# EAGLE design P00R4 (EAGLE 9.6.1)
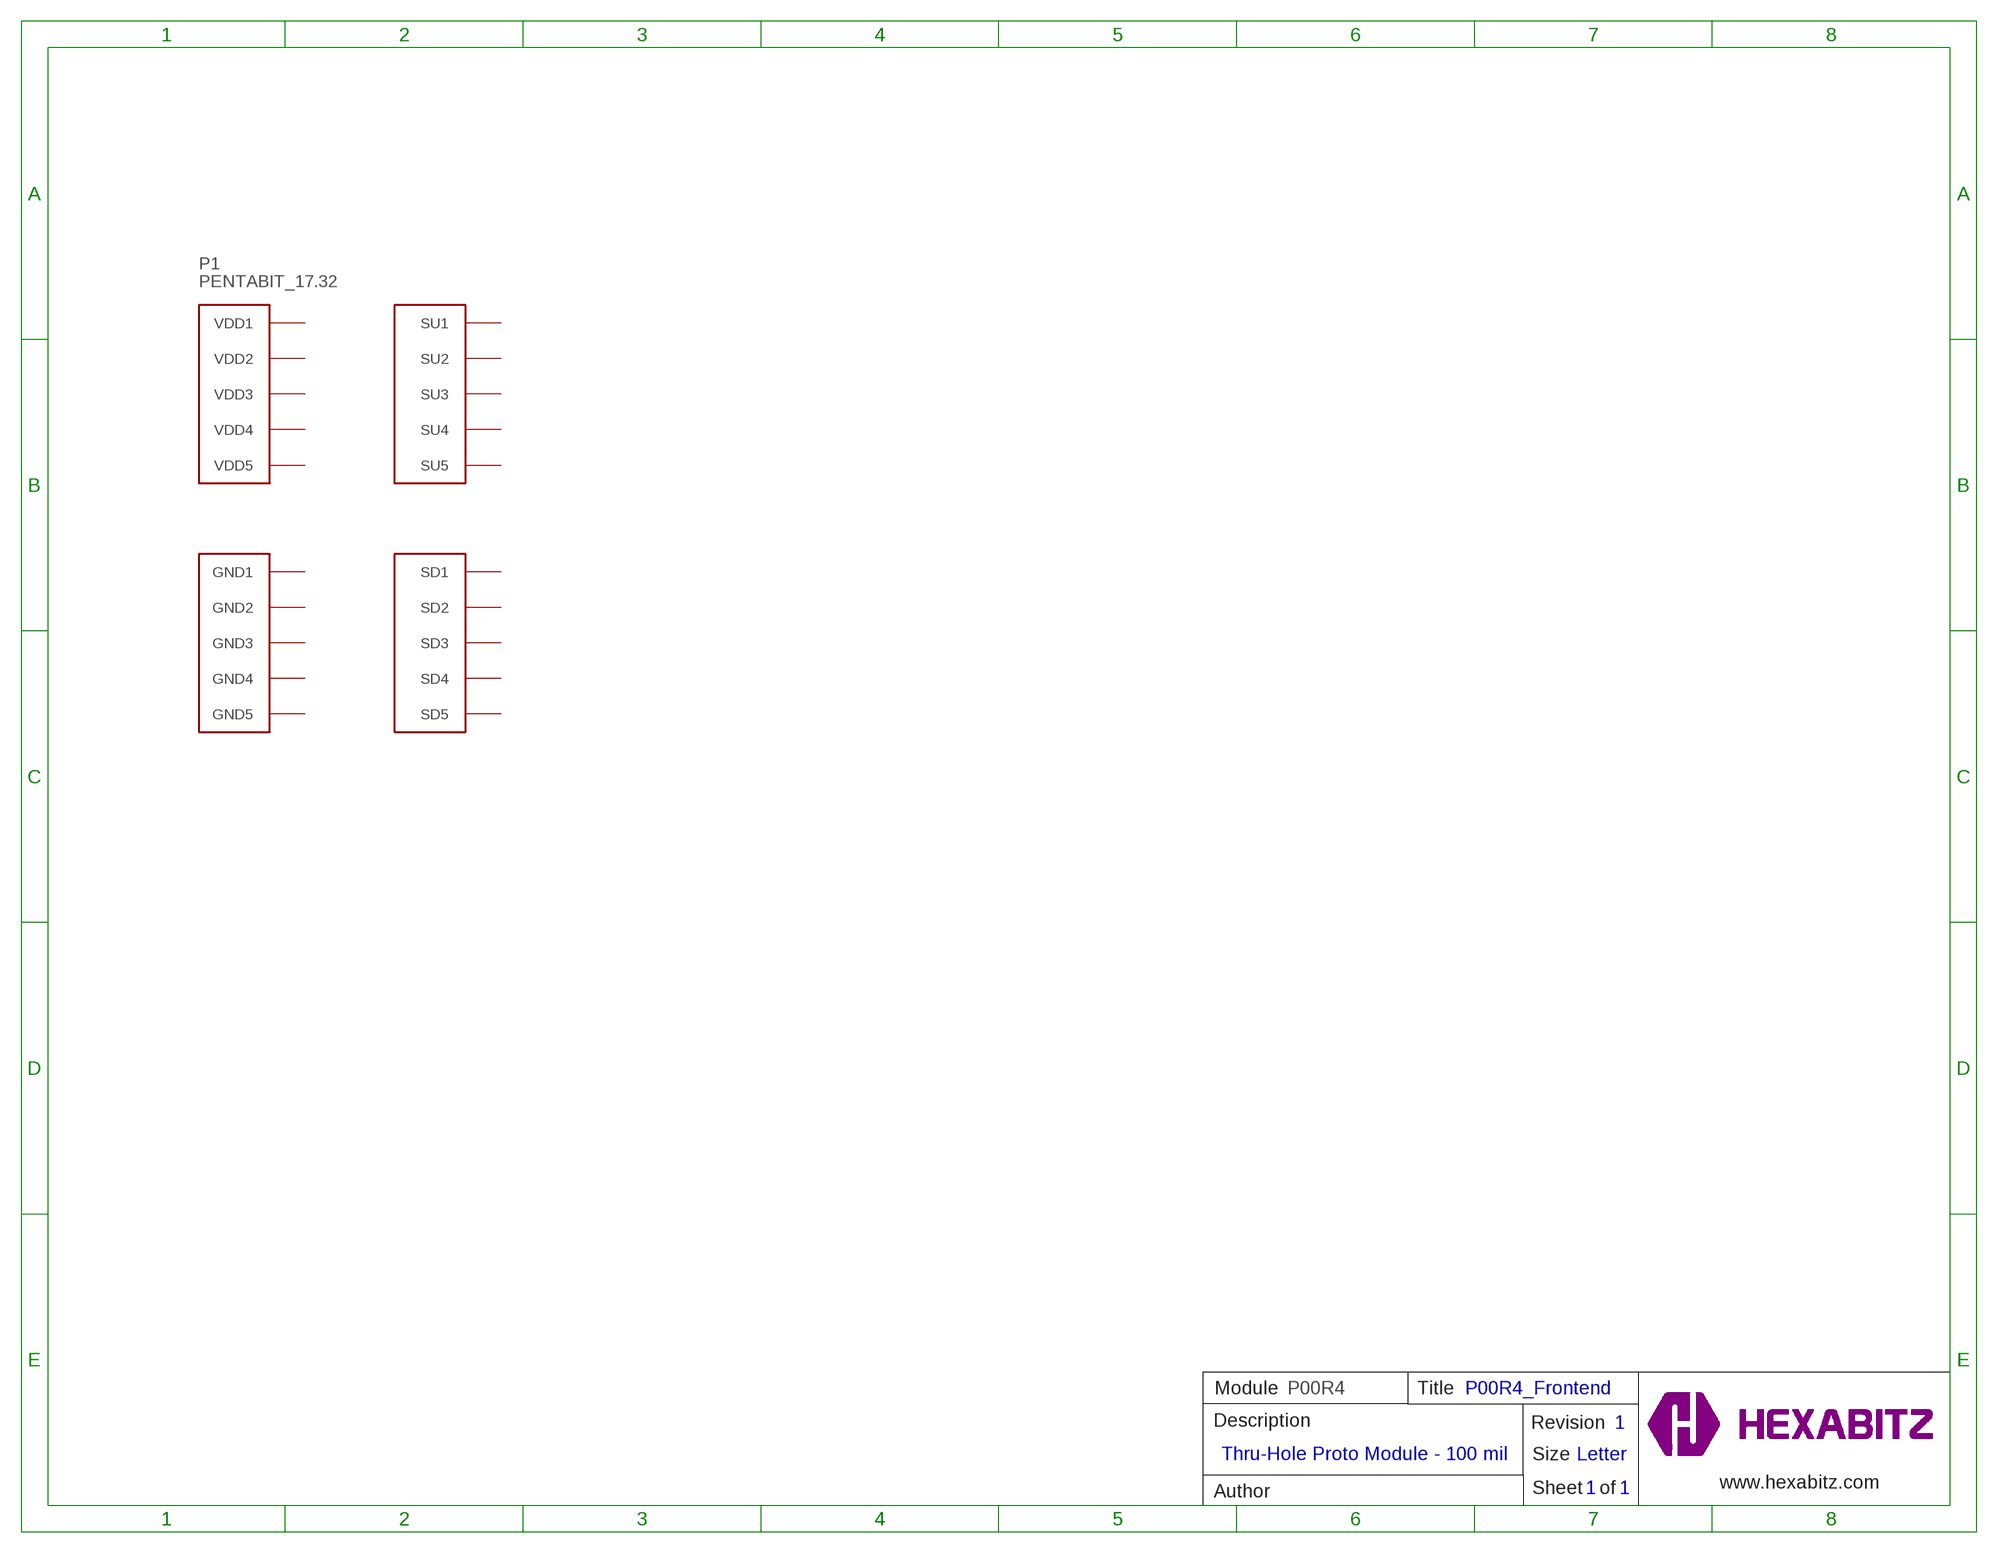
[diagram p0: schematic, sheet 1]

## Parts
P1  PENTABIT_17.32  [PENTABIT_17.32]
Unconnected: P1.PAD_PD1(SD1) P1.PAD_PD2(SD2) P1.PAD_PD3(SD3) P1.PAD_PD4(SD4) P1.PAD_PD5(SD5) P1.PAD_PU1(SU1) P1.PAD_PU2(SU2) P1.PAD_PU3(SU3) P1.PAD_PU4(SU4) P1.PAD_PU5(SU5)

## Notes on the sheet
- Module | P00R4 | Title | P00R4_Frontend
- Description | Revision | 1
- Thru-Hole Proto Module - 100 mil
- Size | Letter
- www.hexabitz.com
- Author | Sheet   of | 1 | 1
- C:/Users/Admin/Desktop/logodraft.bmp

## Power pins joined to a net without a drawn wire
GND1: P1.PAD_PD6(GND1)
GND2: P1.PAD_PD7(GND2)
GND3: P1.PAD_PD8(GND3)
GND4: P1.PAD_PD9(GND4)
GND5: P1.PAD_PD10(GND5)
VDD1: P1.PAD_PU6(VDD1)
VDD2: P1.PAD_PU7(VDD2)
VDD3: P1.PAD_PU8(VDD3)
VDD4: P1.PAD_PU9(VDD4)
VDD5: P1.PAD_PU10(VDD5)

## Library data of the parts
P1 = hexabitz_connectors:PENTABIT_?: Hexabitz Pentagon Module Connector Pentagon side length = 17.32mm.

## Board
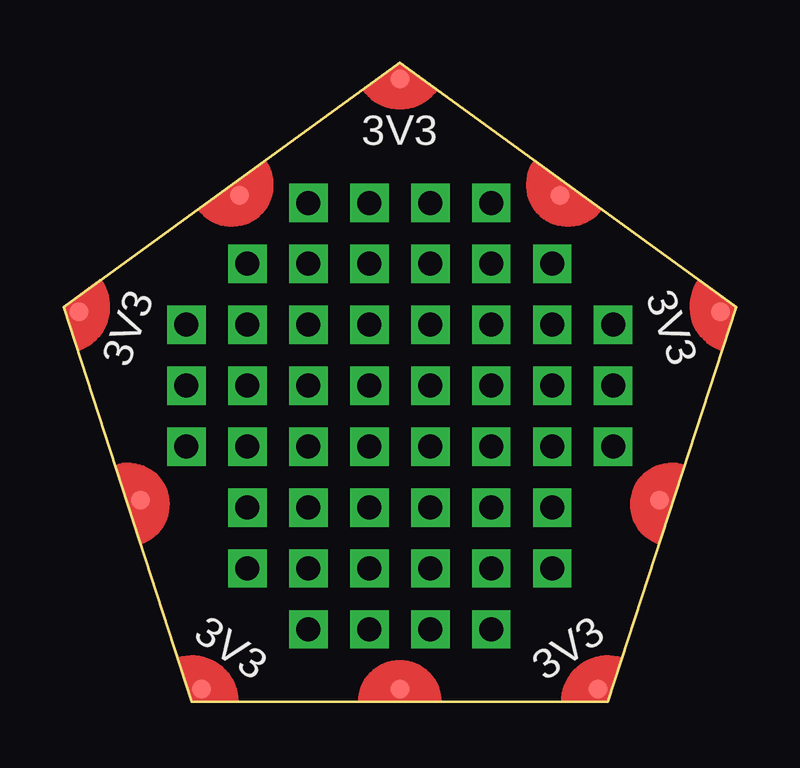
[diagram p1: board, top side]
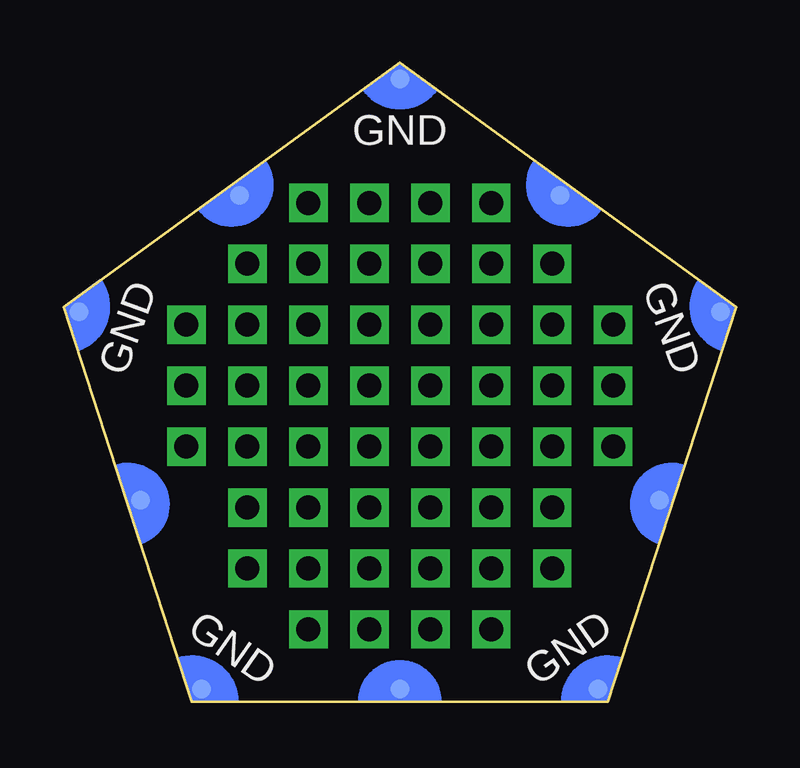
[diagram p2: board, bottom side, seen from below]

Size 28.02 x 26.65 mm. Coordinates in mm from the lower left corner, seen from the top.
Copper layers (1*16): Top 0.035mm / dielectric 1.5mm / Bottom 0.035mm
Design rules "2_layer": minimum track width 7mil, minimum drill 10mil, track to track 6mil, track to pad 6mil, pad to pad 6mil, via to via 6mil, smd to smd 0mil, copper to edge 1mil, drill to drill 8mil, minimum pad ring 10mil, minimum via ring 8mil, stop-mask expansion 2mil, vias tented up to drill 15mil, thermal gap 10mil

### Footprints (pad centres in the part's own frame; a part is rotated, then mirrored left to right if it is on the bottom)
PENTABIT_17.32 = smd 0.8 x 0.8 bottom: PAD_PD1 6.68,9.2; PAD_PD2 10.81,-3.51; PAD_PD3 0,-11.37; PAD_PD4 -10.81,-3.51; PAD_PD5 -6.68,9.2; PAD_PD6 0,14.05; PAD_PD7 13.36,4.34; PAD_PD8 8.26,-11.37; PAD_PD9 -8.26,-11.37; PAD_PD10 -13.36,4.34 | smd 0.8 x 0.8: PAD_PU1 6.68,9.2; PAD_PU2 10.81,-3.51; PAD_PU3 0,-11.37; PAD_PU4 -10.81,-3.51; PAD_PU5 -6.68,9.2; PAD_PU6 0,14.05; PAD_PU7 13.36,4.34; PAD_PU8 8.26,-11.37; PAD_PU9 -8.26,-11.37; PAD_PU10 -13.36,4.34

### Placement (x,y rotation side)
P1  14.01,11.92 0 top

### Tracks (layer width: path | path; a pad name or v marks a point on that pad's centre or on a via)
N$12  (via drill 1 pad 1.6)
  other vias: 12.74,13.19
N$13  (via drill 1 pad 1.6)
  other vias: 12.74,10.65
N$14  (via drill 1 pad 1.6)
  other vias: 15.28,13.19
N$15  (via drill 1 pad 1.6)
  other vias: 15.28,10.65
N$16  (via drill 1 pad 1.6)
  other vias: 10.2,10.65
N$17  (via drill 1 pad 1.6)
  other vias: 7.66,10.65
N$18  (via drill 1 pad 1.6)
  other vias: 5.12,10.65
N$21  (via drill 1 pad 1.6)
  other vias: 5.12,13.19
N$22  (via drill 1 pad 1.6)
  other vias: 7.66,13.19
N$23  (via drill 1 pad 1.6)
  other vias: 10.2,13.19
N$24  (via drill 1 pad 1.6)
  other vias: 17.82,13.19
N$25  (via drill 1 pad 1.6)
  other vias: 20.36,13.19
N$26  (via drill 1 pad 1.6)
  other vias: 22.9,13.19
N$29  (via drill 1 pad 1.6)
  other vias: 22.9,10.65
N$30  (via drill 1 pad 1.6)
  other vias: 20.36,10.65
N$31  (via drill 1 pad 1.6)
  other vias: 17.82,10.65
N$32  (via drill 1 pad 1.6)
  other vias: 7.66,15.73
N$33  (via drill 1 pad 1.6)
  other vias: 5.12,15.73
N$34  (via drill 1 pad 1.6)
  other vias: 10.2,15.73
N$35  (via drill 1 pad 1.6)
  other vias: 12.74,15.73
N$36  (via drill 1 pad 1.6)
  other vias: 15.28,15.73
N$37  (via drill 1 pad 1.6)
  other vias: 17.82,15.73
N$38  (via drill 1 pad 1.6)
  other vias: 20.36,15.73
N$39  (via drill 1 pad 1.6)
  other vias: 22.9,15.73
N$41  (via drill 1 pad 1.6)
  other vias: 7.66,8.11
N$42  (via drill 1 pad 1.6)
  other vias: 10.2,8.11
N$43  (via drill 1 pad 1.6)
  other vias: 12.74,8.11
N$44  (via drill 1 pad 1.6)
  other vias: 15.28,8.11
N$45  (via drill 1 pad 1.6)
  other vias: 17.82,8.11
N$46  (via drill 1 pad 1.6)
  other vias: 20.36,8.11
N$48  (via drill 1 pad 1.6)
  other vias: 7.66,5.57
N$49  (via drill 1 pad 1.6)
  other vias: 10.2,5.57
N$50  (via drill 1 pad 1.6)
  other vias: 12.74,5.57
N$51  (via drill 1 pad 1.6)
  other vias: 15.28,5.57
N$52  (via drill 1 pad 1.6)
  other vias: 17.82,5.57
N$53  (via drill 1 pad 1.6)
  other vias: 20.36,5.57
N$54  (via drill 1 pad 1.6)
  other vias: 7.66,18.27
N$55  (via drill 1 pad 1.6)
  other vias: 10.2,18.27
N$56  (via drill 1 pad 1.6)
  other vias: 12.74,18.27
N$57  (via drill 1 pad 1.6)
  other vias: 15.28,18.27
N$58  (via drill 1 pad 1.6)
  other vias: 17.82,18.27
N$59  (via drill 1 pad 1.6)
  other vias: 20.36,18.27
N$61  (via drill 1 pad 1.6)
  other vias: 17.82,20.81
N$62  (via drill 1 pad 1.6)
  other vias: 15.28,20.81
N$63  (via drill 1 pad 1.6)
  other vias: 12.74,20.81
N$64  (via drill 1 pad 1.6)
  other vias: 10.2,20.81
N$79  (via drill 1 pad 1.6)
  other vias: 10.2,3.03
N$80  (via drill 1 pad 1.6)
  other vias: 12.74,3.03
N$81  (via drill 1 pad 1.6)
  other vias: 15.28,3.03
N$82  (via drill 1 pad 1.6)
  other vias: 17.82,3.03

### Text on the board
tPlace: 3V3 | 3V3 | 3V3 | 3V3 | 3V3
bPlace: GND | GND | GND | GND | GND